# Altium schematic sheet PMIC.SchDoc
size A4; SheetNumber: 3; SheetTotal: 6
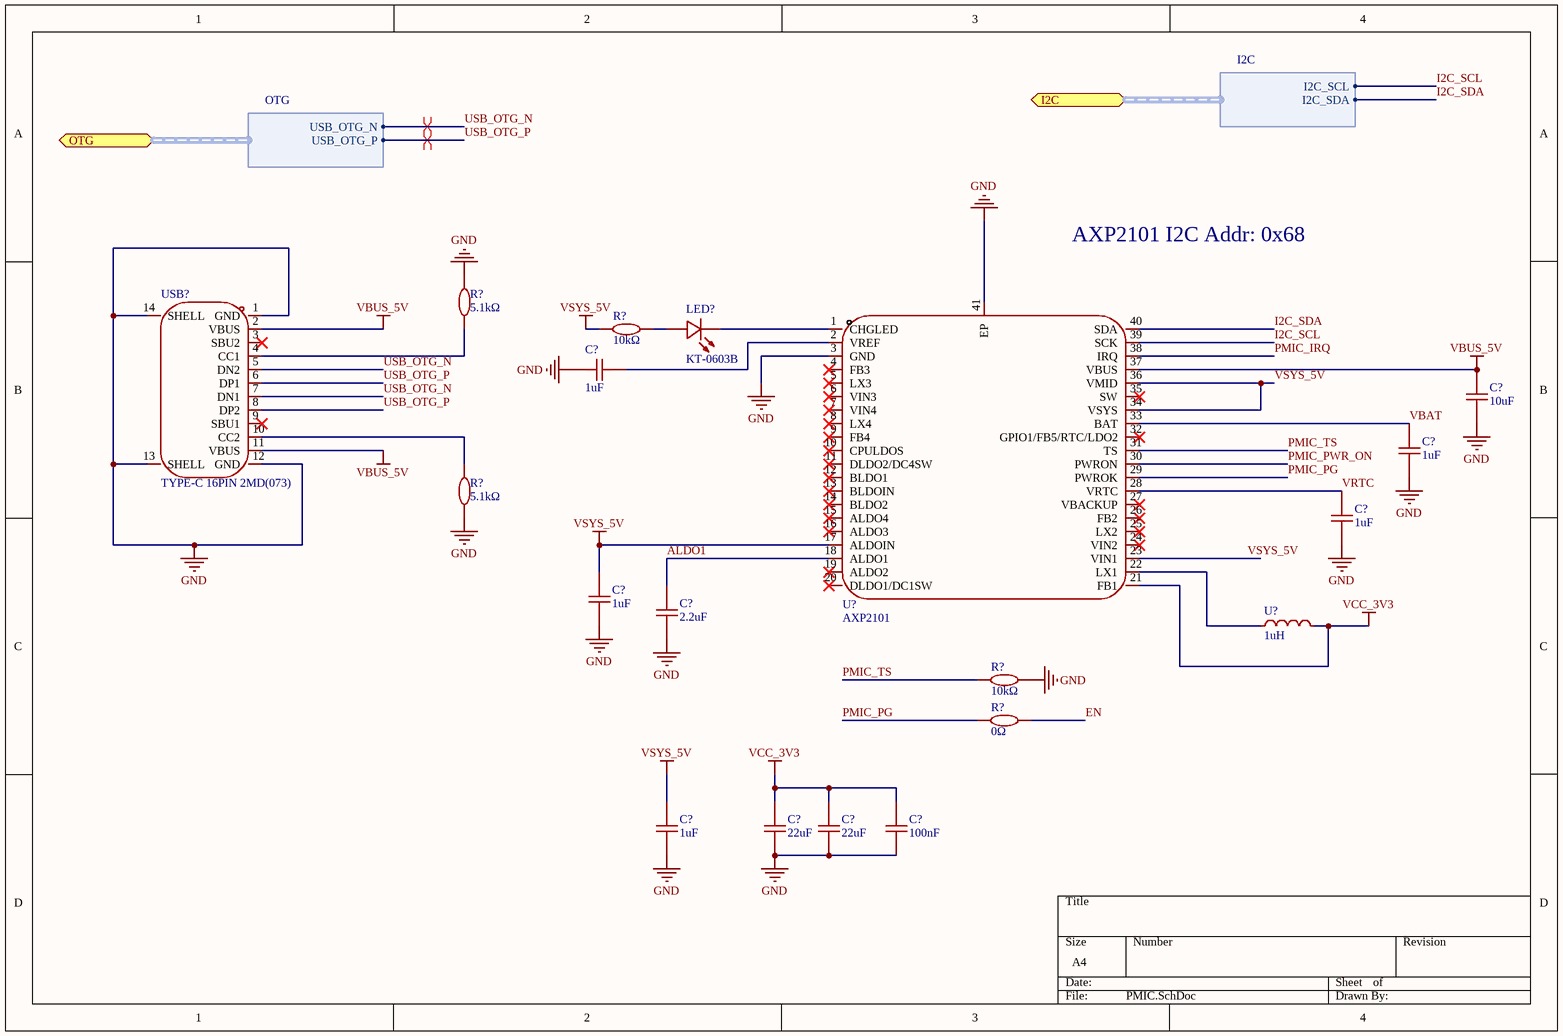
[diagram p0: PMIC.SchDoc]

## Parts
(Parts that share a designator on the sheet are numbered #1, #2 ... from top to bottom, then left to right.)
C?#1  1uF  [C0402]
C?#2  10uF  [C0603]
C?#3  1uF  [C0402]
C?#4  1uF  [C0402]
C?#5  1uF  [C0402]
C?#6  2.2uF  [C0402]
C?#7  1uF  [C0402]
C?#8  22uF  [C0603]
C?#9  22uF  [C0603]
C?#10  100nF  [C0402]
LED?  KT-0603B  [LED0603-BL]
R?#1  5.1kΩ  [R0402]
R?#2  10kΩ  [R0402]
R?#3  5.1kΩ  [R0402]
R?#4  10kΩ  [R0402]
R?#5  0Ω  [R0402]
U?#1  AXP2101  [QFN-40_L5.0-W5.0-P0.40-TL-EP3.4]
U?#2  1uH  [IND-SMD_L2.5-W2.0_WPN252012H]
USB?  TYPE-C 16PIN 2MD(073)  [USB-C-SMD_TYPE-C-6PIN-2MD-073]

## Ports
I2C (bidir, harness I2C), OTG (bidir, harness OTG)

## Harnesses
OTG: USB_OTG_N, USB_OTG_P
I2C: I2C_SCL, I2C_SDA

## Nets
GND: C?#1.1 C?#2.1 C?#3.1 C?#4.1 C?#5.1 C?#6.1 C?#7.1 C?#8.1 C?#9.1 C?#10.1 R?#1.2 R?#3.1 R?#4.2 U?#1.3(GND) U?#1.41(EP) USB?.1(GND) USB?.12(GND) USB?.13(SHELL) USB?.14(SHELL)
VBUS_5V: C?#2.2 U?#1.37(VBUS) USB?.2(VBUS) USB?.11(VBUS)
VCC_3V3: C?#8.2 C?#9.2 C?#10.2 U?#1.21(FB1) U?#2.2
VSYS_5V: C?#5.2 C?#7.2 R?#2.1 U?#1.17(ALDOIN) U?#1.23(VIN1) U?#1.34(VSYS) U?#1.36(VMID)
ALDO1: C?#6.2 U?#1.18(ALDO1)
EN: R?#5.2
I2C_SCL: U?#1.39(SCK) ; port I2C.I2C_SCL
I2C_SDA: U?#1.40(SDA) ; port I2C.I2C_SDA
PMIC_IRQ: U?#1.38(IRQ)
PMIC_PG: R?#5.1 U?#1.29(PWROK)
PMIC_PWR_ON: U?#1.30(PWRON)
PMIC_TS: R?#4.1 U?#1.31(TS)
USB_OTG_N: USB?.5(DN2) USB?.7(DN1) ; port OTG.USB_OTG_N
USB_OTG_P: USB?.6(DP1) USB?.8(DP2) ; port OTG.USB_OTG_P
VBAT: C?#3.2 U?#1.33(BAT)
VRTC: C?#4.2 U?#1.28(VRTC)
NetC?#1_2: C?#1.2 U?#1.2(VREF)
NetLED?_1: LED?.1(K) U?#1.1(CHGLED)
NetLED?_2: LED?.2(A) R?#2.2
NetR?#1_1: R?#1.1 USB?.4(CC1)
NetR?#3_2: R?#3.2 USB?.10(CC2)
NetU?#1_22: U?#1.22(LX1) U?#2.1

Not connected (* = marked no-connect by the designer): U?#1 4(FB3)* 5(LX3)* 6(VIN3)* 7(VIN4)* 8(LX4)* 9(FB4)* 10(CPULDOS)* 11(DLDO2/DC4SW)* 12(BLDO1)* 13(BLDOIN)* 14(BLDO2)* 15(ALDO4)* 16(ALDO3)* 19(ALDO2)* 20(DLDO1/DC1SW)* 24(VIN2)* 25(LX2)* 26(FB2)* 27(VBACKUP)* 32(GPIO1/FB5/RTC/LDO2)* 35(SW)*; USB? 3(SBU2)* 9(SBU1)*

## Layout directives
differential pair: USB_OTG_N, USB_OTG_P

## Notes on the sheet
- AXP2101 I2C Addr: 0x68

## Library data of the parts
C?#1 C?#3-C?#5 C?#7 = 1uF: 50V 1uF X5R ±10% 0402 Ceramic Capacitors ROHS
C?#2 = 10uF: 10V 10uF X5R ±10% 0603 Ceramic Capacitors ROHS
C?#6 = 2.2uF: 50V 2.2uF NP0 0402 Ceramic Capacitors ROHS
C?#8 C?#9 = 22uF: 16V 22uF X5R ±20% 0603 Ceramic Capacitors ROHS
C?#10 = 100nF: 50V 100nF X7R ±10% 0402 Ceramic Capacitors ROHS
LED? = KT-0603B: 30mA 2.6V~3.2V Blue 0603 LED Indication - Discrete ROHS
R?#1 R?#3 = 5.1kΩ: 5.1kΩ 62.5mW 50V ±100ppm/℃ Thick Film Resistor ±1% 0402 Chip Resistor - Surface Mount ROHS
R?#2 R?#4 = 10kΩ: 62.5mW 10kΩ 50V ±100ppm/℃ Thick Film Resistor ±1% 0402 Chip Resistor - Surface Mount ROHS
R?#5 = 0Ω: 0Ω 62.5mW 50V Thick Film Resistor ±1% 0402 Chip Resistor - Surface Mount ROHS
U?#2 = WPN252012H1R0MT
USB? = TYPE-C 16PIN 2MD(073): 16pin type-c